# Altium schematic sheet MainSchema.SchDoc
size A4
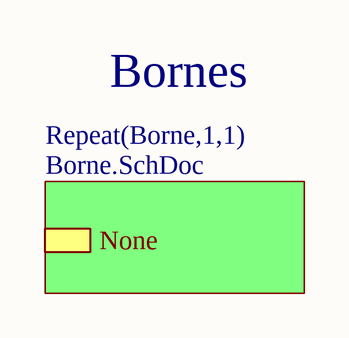
[diagram p0: MainSchema.SchDoc]

## Sub-sheets
Repeat(Borne,1,1) = Borne.SchDoc: None

## Notes on the sheet
- Bornes